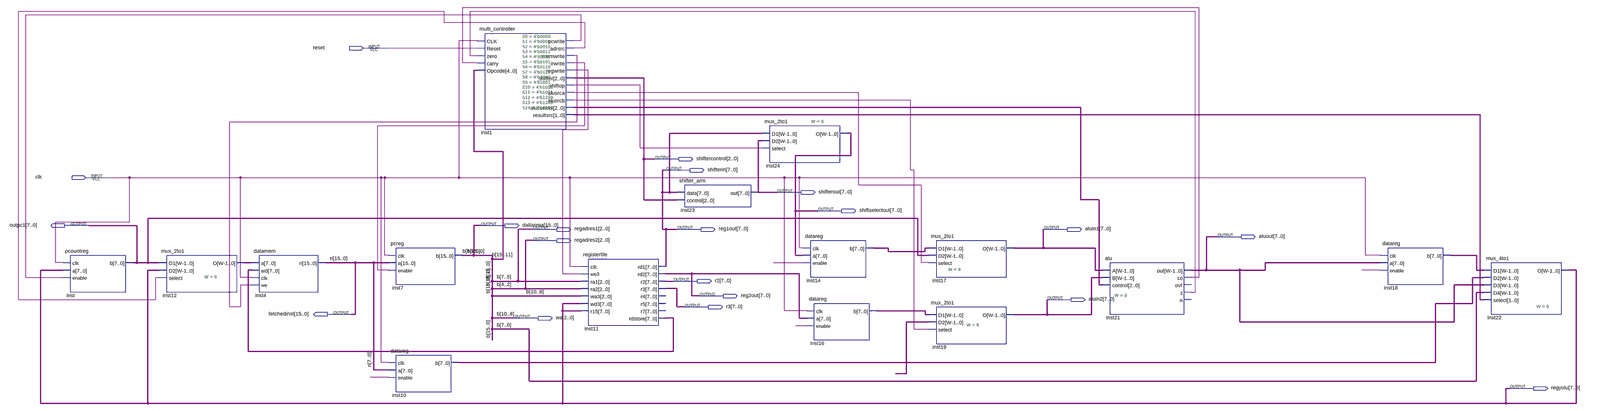
[diagram p0: schematic sheet, whole]
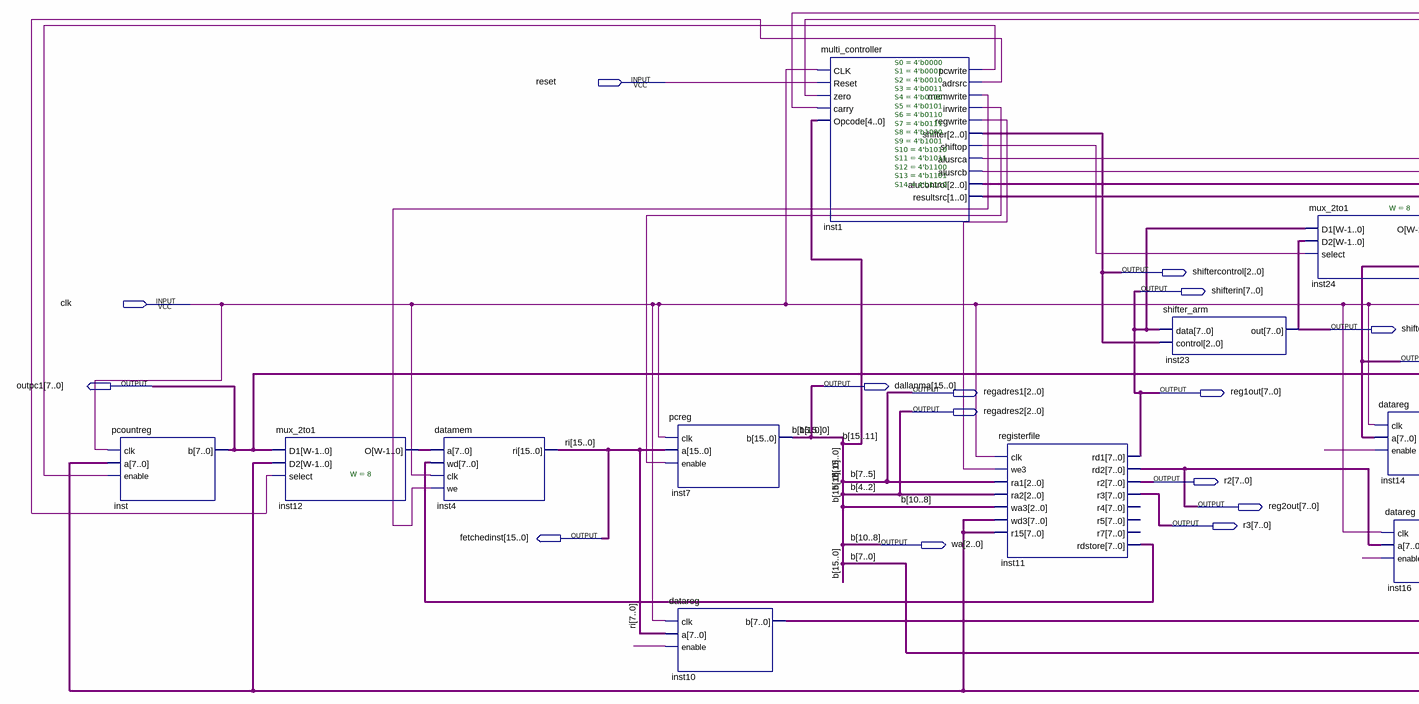
[diagram p1: schematic sheet, left part]
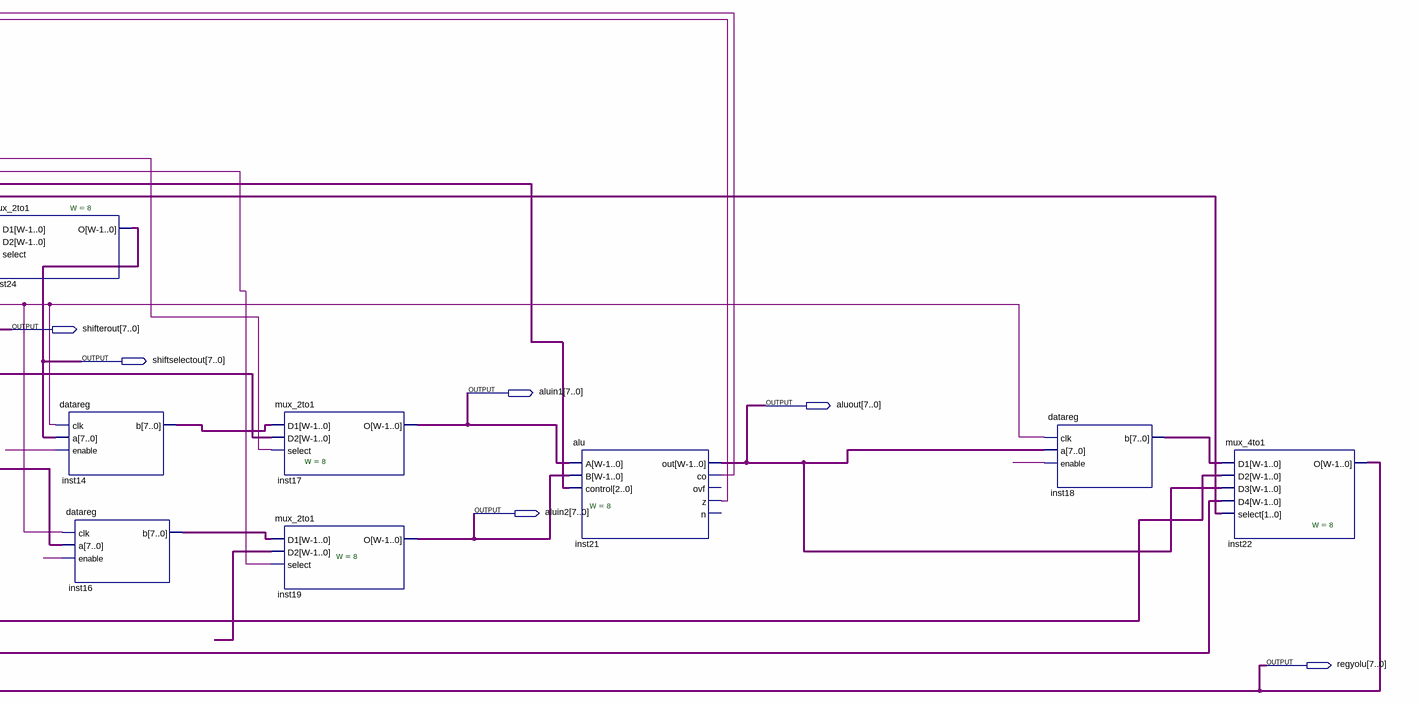
[diagram p2: schematic sheet, right part]
// Quartus schematic multicycle.bdf as structural Verilog: 16 symbols, 20 pins
module multicycle (
  input  reset,
  input  clk,
  output [2:0] shiftercontrol,
  output [7:0] shifterin,
  output [7:0] shifterout,
  output [7:0] shiftselectout,
  output [7:0] outpc1,
  output [15:0] dallanma,
  output [2:0] regadres1,
  output [7:0] reg1out,
  output [7:0] aluin1,
  output [7:0] aluout,
  output [2:0] regadres2,
  output [7:0] r2,
  output [7:0] reg2out,
  output [7:0] aluin2,
  output [7:0] r3,
  output [15:0] fetchedinst,
  output [2:0] wa,
  output [7:0] regyolu
);

  wire inst1_adrsrc, inst1_alusrca, inst1_alusrcb, inst1_irwrite, inst1_memwrite, inst1_pcwrite,
       inst1_regwrite, inst1_shiftop, inst21_co, inst21_z, undriven, undriven_2, undriven_3, undriven_4;
  wire [1:0] inst1_resultsrc;
  wire [2:0] inst1_alucontrol;
  wire [7:0] inst10_b, inst11_rdstore, inst12_o, inst14_b, inst16_b, inst18_b, undriven_5;

  pcountreg inst (.clk(clk), .a(regyolu), .enable(inst1_pcwrite), .b(outpc1));
  mux_2to1 #(.W(8)) inst12 (.D1(outpc1), .D2(regyolu), .select(inst1_adrsrc), .O(inst12_o));
  datamem inst4 (.a(inst12_o), .wd(inst11_rdstore), .clk(clk), .we(inst1_memwrite), .ri(fetchedinst));
  pcreg inst7 (.clk(clk), .a(fetchedinst), .enable(inst1_irwrite), .b(dallanma));
  datareg inst10 (.clk(clk), .a(fetchedinst[7:0]), .enable(undriven_4), .b(inst10_b));
  multi_controller #(.S0(4'b0000), .S1(4'b0001), .S2(4'b0010), .S3(4'b0011), .S4(4'b0100), .S5(4'b0101), .S6(4'b0110), .S7(4'b0111), .S8(4'b1000), .S9(4'b1001), .S10(4'b1010), .S11(4'b1011), .S12(4'b1100), .S13(4'b1101), .S14(4'b1110)) inst1 (
    .CLK(clk), .Reset(reset), .zero(inst21_z), .carry(inst21_co), .Opcode(dallanma[15:11]),
    .pcwrite(inst1_pcwrite), .adrsrc(inst1_adrsrc), .memwrite(inst1_memwrite), .irwrite(inst1_irwrite),
    .regwrite(inst1_regwrite), .shifter(shiftercontrol), .shiftop(inst1_shiftop), .alusrca(inst1_alusrca),
    .alusrcb(inst1_alusrcb), .alucontrol(inst1_alucontrol), .resultsrc(inst1_resultsrc));
  registerfile inst11 (
    .clk(clk), .we3(inst1_regwrite), .ra1(dallanma[7:5]), .ra2(dallanma[4:2]), .wa3(dallanma[10:8]),
    .wd3(regyolu), .r15(regyolu), .rd1(reg1out), .rd2(reg2out), .r2(r2), .r3(r3), .rdstore(inst11_rdstore));  // open: r4, r5, r7
  shifter_arm inst23 (.data(reg1out), .control(shiftercontrol), .out(shifterout));
  mux_2to1 #(.W(8)) inst24 (.D1(reg1out), .D2(shifterout), .select(inst1_shiftop), .O(shiftselectout));
  datareg inst14 (.clk(clk), .a(shiftselectout), .enable(undriven), .b(inst14_b));
  datareg inst16 (.clk(clk), .a(reg2out), .enable(undriven_2), .b(inst16_b));
  mux_2to1 #(.W(8)) inst17 (.D1(inst14_b), .D2(outpc1), .select(inst1_alusrca), .O(aluin1));
  mux_2to1 #(.W(8)) inst19 (.D1(inst16_b), .D2(undriven_5), .select(inst1_alusrcb), .O(aluin2));
  alu #(.W(8)) inst21 (
    .A(aluin1), .B(aluin2), .control(inst1_alucontrol), .out(aluout), .co(inst21_co), .z(inst21_z));  // open: ovf, n
  datareg inst18 (.clk(clk), .a(aluout), .enable(undriven_3), .b(inst18_b));
  mux_4to1 #(.W(8)) inst22 (
    .D1(inst18_b), .D2(inst10_b), .D3(aluout), .D4(dallanma[7:0]), .select(inst1_resultsrc), .O(regyolu));

  assign regadres1 = dallanma[7:5];
  assign regadres2 = dallanma[4:2];
  assign shifterin = reg1out;
  assign wa = dallanma[10:8];

  // Other names for the same wires on the sheet: b[15:0] = dallanma; ri[15:0] = fetchedinst
endmodule
